# EAGLE design mutteruhr-Haus (EAGLE 7.7.0)
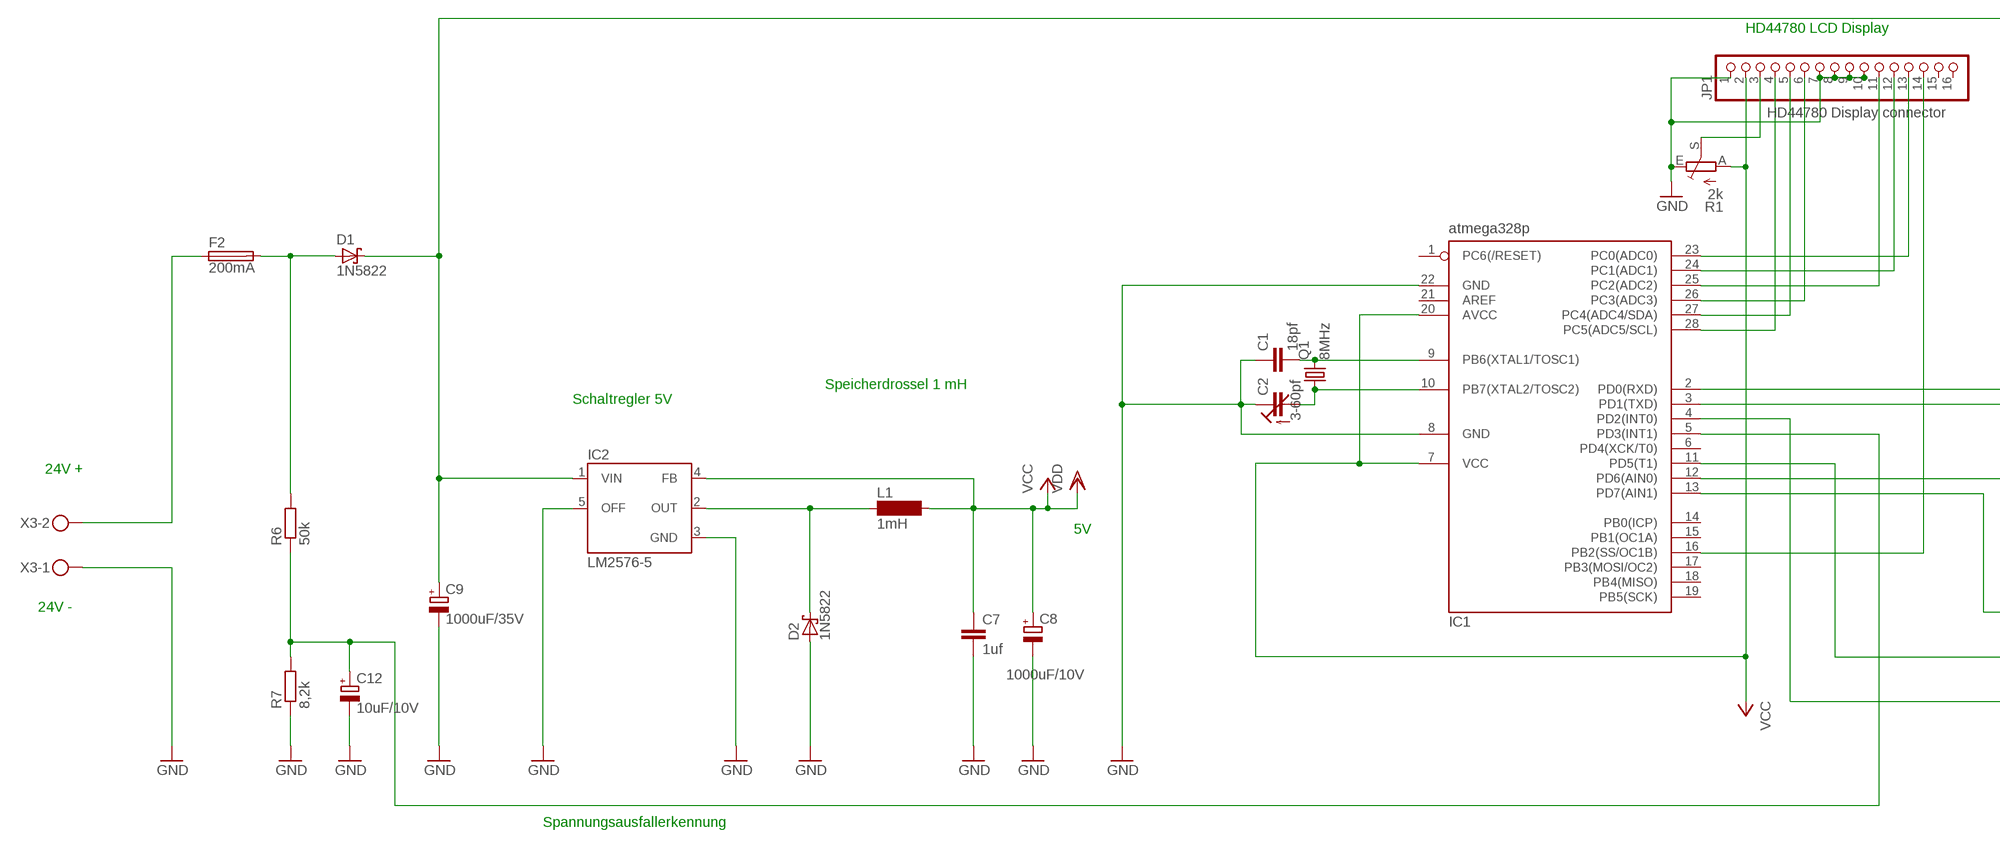
[diagram p0: schematic, sheet 1, part 1 of 2]
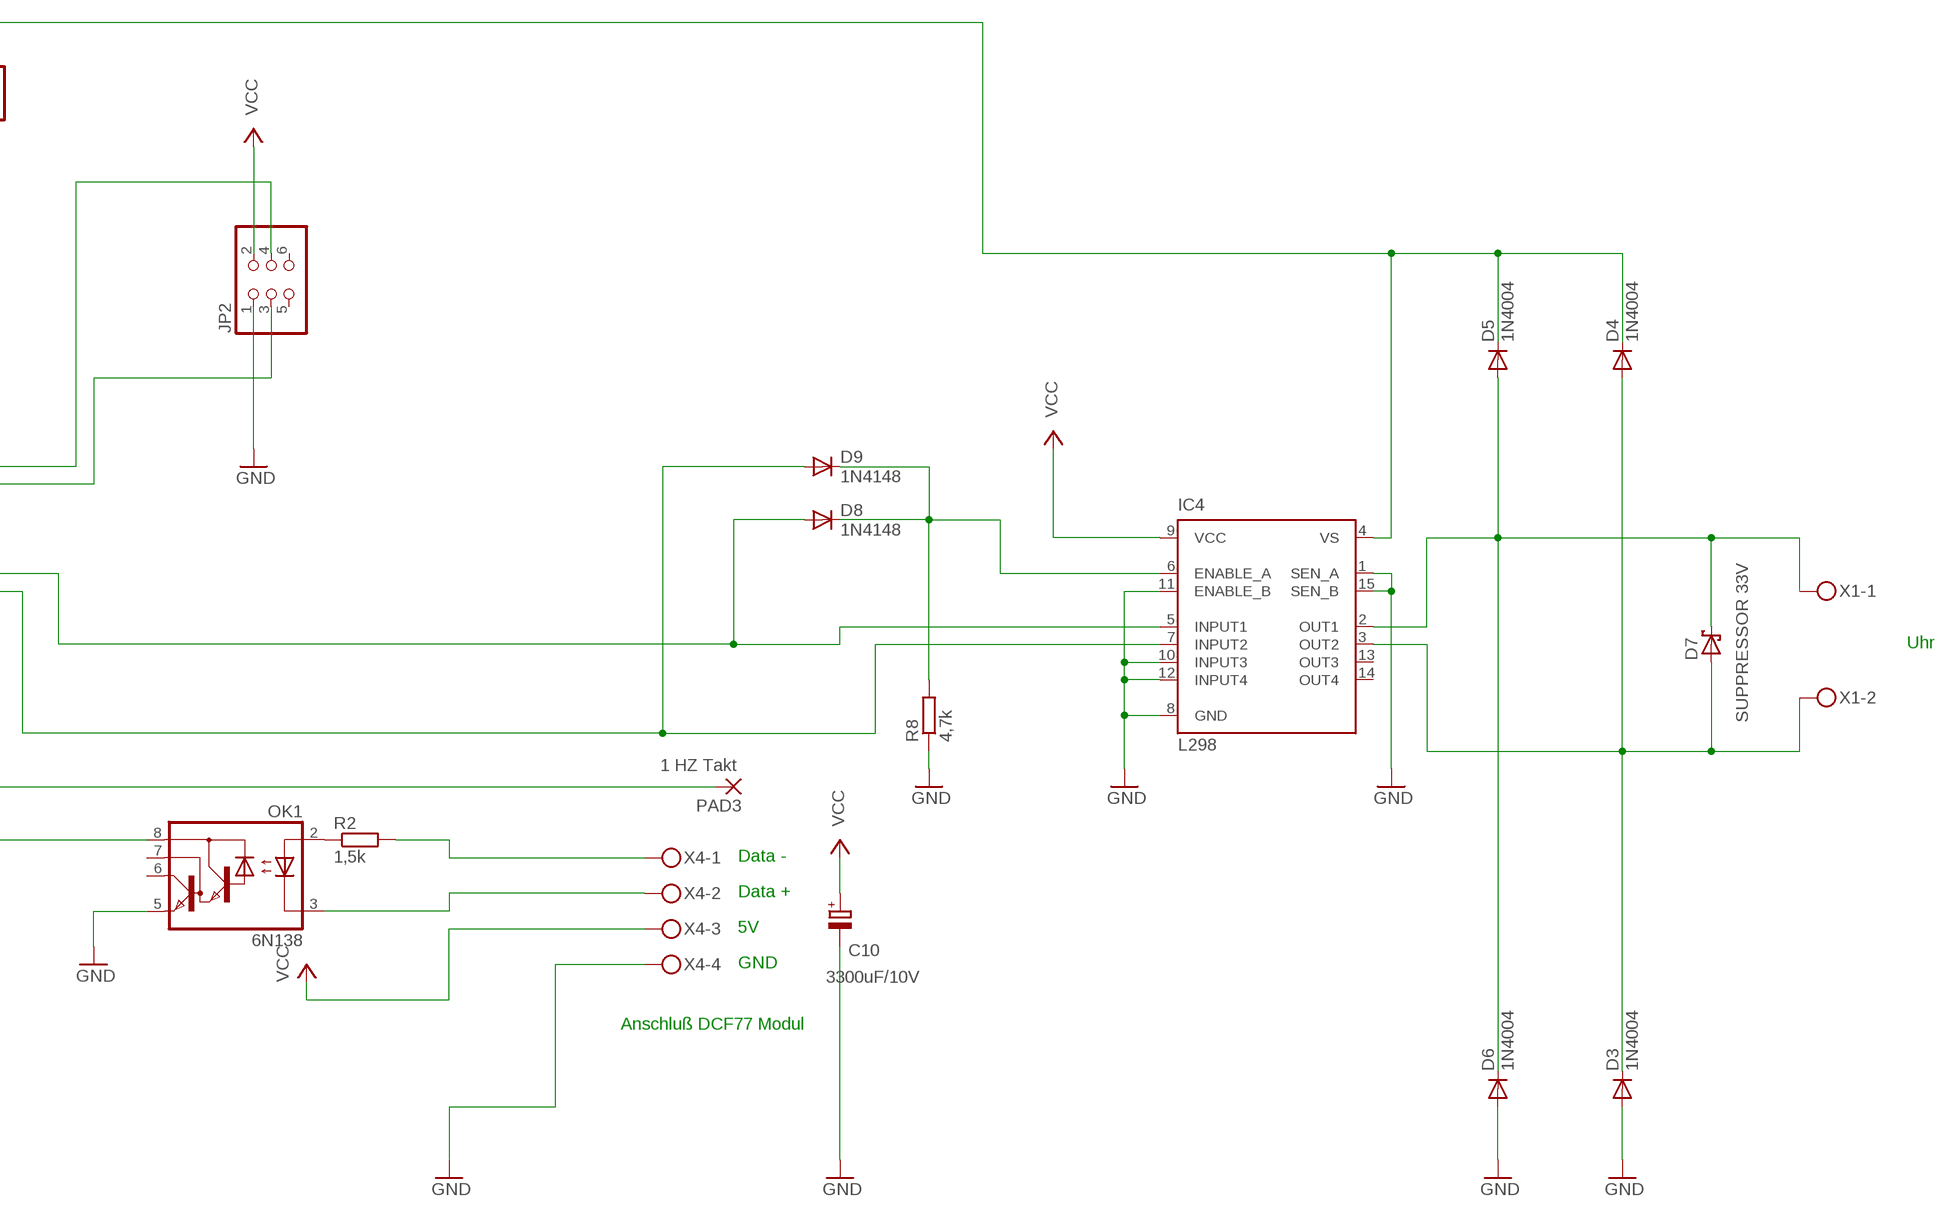
[diagram p1: schematic, sheet 1, part 2 of 2]

## Parts
C1  18pf  C-EU050-024X044  [C050-024X044]
C2  3-60pf  C-TRIMM3050.505  [CTRIM3050.505]
C7  1uf  C5/5.5  [C5B5.5]
C8  1000uF/10V  CPOL-EUE5-8.5  [E5-8,5]
C9  1000uF/35V  CPOL-EUE5-8.5  [E5-8,5]
C10  3300uF/10V  CPOL-EUE7.5-16  [E7,5-16]
C12  10uF/10V  CPOL-EUE5-5  [E5-5]
D1  1N5822  1N5819-B  [DO41-7.6]
D2  1N5822  1N5819-B  [DO41-7.6]
D3  1N4004  [DO41-10]
D4  1N4004  [DO41-10]
D5  1N4004  [DO41-10]
D6  1N4004  [DO41-10]
D7  SUPPRESSOR 33V  P4KEXX  [DO41-10]
D8  1N4148  1N4148DO35-7  [DO35-7]
D9  1N4148  1N4148DO35-7  [DO35-7]
F2  200mA  SH25  [SH25]
IC1  atmega328p  MEGA8-P  [DIL28-3]
IC2  LM2576-5  LM2576T  [TO220-5]
IC4  L298  [MULTIWATT-15]
JP1  HD44780 Display connector  PINHD-1X16_2.54  [1X16]
JP2  PINHD-2X3  [2X03]
L1  1mH  BS11  [BS11]
OK1  6N138  [DIL08]
PAD3  1 HZ Takt  2,54/0,8  [2,54/0,8]
Q1  8MHz  CRYSTALHC18U-V  [HC18U-V]
R1  2k  TRIM_EU-RS3  [RS3]
R2  1,5k  R-EU_0207/10  [0207/10]
R6  50k  R-EU_0207/10  [0207/10]
R7  8,2k  R-EU_0207/10  [0207/10]
R8  4,7k  R-EU_0207/10  [0207/10]
X1  MKDSN1,5/2-5,08  [MKDSN1,5/2-5,08]
X3  MKDSN1,5/2-5,08  [MKDSN1,5/2-5,08]
X4  MKDSN1,5/4-5,08  [MKDSN1,5/4-5,08]

## Nets
GND: C1.1 C2.1(E) C7.2 C8.- C9.- C10.- C12.- D2.A D3.A D6.A IC1.8(GND) IC1.22(GND) IC2.3(GND) IC2.5(OFF) IC4.1(SEN_A) IC4.8(GND) IC4.10(INPUT3) IC4.11(ENABLE_B) IC4.12(INPUT4) IC4.15(SEN_B) JP1.1 JP1.7 JP1.8 JP1.9 JP1.10 JP2.1 OK1.5(GND) R1.E R7.1 R8.1 X3.1 X4.4
N$1: IC1.4(PD2(INT0)) OK1.8(VCC)
N$2: C1.2 IC1.9(PB6(XTAL1/TOSC1)) Q1.2
N$3: C2.2(A) IC1.10(PB7(XTAL2/TOSC2)) Q1.1
N$4: IC1.23(PC0(ADC0)) JP1.13
N$5: IC1.24(PC1(ADC1)) JP1.12
N$6: IC1.25(PC2(ADC2)) JP1.11
N$7: IC1.26(PC3(ADC3)) JP1.6
N$8: IC1.27(PC4(ADC4/SDA)) JP1.5
N$9: IC1.28(PC5(ADC5/SCL)) JP1.4
N$10: IC1.16(PB2(SS/OC1B)) JP1.14
N$12: JP1.3 R1.S
N$14: IC1.2(PD0(RXD)) JP2.4
N$15: IC1.3(PD1(TXD)) JP2.3
N$22: D9.A IC1.13(PD7(AIN1)) IC4.7(INPUT2)
N$23: OK1.2(A) R2.1
N$25: IC1.11(PD5(T1)) PAD3.1(P)
N$26: D1.A F2.2 R6.2
N$27: OK1.3(C) X4.2
N$28: C9.+ D1.C D4.C D5.C IC2.1(VIN) IC4.4(VS)
N$29: F2.1 X3.2
N$32: R2.2 X4.1
N$33: C12.+ IC1.5(PD3(INT1)) R6.1 R7.2
N$39: D2.C IC2.2(OUT) L1.1
N$41: D8.C D9.C IC4.6(ENABLE_A) R8.2
N$43: D3.C D4.A D7.A IC4.3(OUT2) X1.2
N$44: D8.A IC1.12(PD6(AIN0)) IC4.5(INPUT1)
N$56: D5.A D6.C D7.C IC4.2(OUT1) X1.1
VCC: C7.1 C8.+ C10.+ IC1.7(VCC) IC1.20(AVCC) IC2.4(FB) IC4.9(VCC) JP1.2 JP2.2 L1.2 R1.A X4.3 ; supply symbol labelled VDD
Unconnected: IC1.1(PC6(/RESET)) IC1.6(PD4(XCK/T0)) IC1.14(PB0(ICP)) IC1.15(PB1(OC1A)) IC1.17(PB3(MOSI/OC2)) IC1.18(PB4(MISO)) IC1.19(PB5(SCK)) IC1.21(AREF) IC4.13(OUT3) IC4.14(OUT4) JP1.15 JP1.16 JP2.5 JP2.6 OK1.6(VO) OK1.7(VB)

## Notes on the sheet
- HD44780 LCD Display
- Speicherdrossel 1 mH
- Schaltregler 5V
- 24V +
- 5V
- Uhr
- 24V -
- Data -
- Data +
- 5V
- GND
- Spannungsausfallerkennung
- Anschluß DCF77 Modul

## Library data of the parts
C1 = rcl:C-EU: CAPACITOR, European symbol
C2 = rcl:C-TRIMM: Trimm capacitor
C7 = capacitor-wima:C: CAPACITOR naming: grid - package width
C8-C10 = rcl:CPOL-EU: POLARIZED CAPACITOR, European symbol
C12 = rcl-2:CPOL-EU: POLARIZED CAPACITOR, European symbol
D1 D2 = diode:1N581*: 1.0A SCHOTTKY BARRIER RECTIFIER Source: http://www.diodes.com/datasheets/ds23001.pdf
D3-D6 = diode:1N4004: DIODE general purpose rectifier, 1 A
D7 = diode:P4KEXX: DIODE transient-voltage suppressor
D8 D9 = diode:1N4148: DIODE high speed (Philips)
F2 = fuse:SH25: FUSE HOLDER grid 25 mm, OGN0031 8211, Schurter (Buerklin); MF: SCHURTER; MPN: 0031.8211; OC_FARNELL: 1162741; OC_NEWARK: 96B9380
IC1 = atmel:MEGA8-P: MICROCONTROLLER 8 Kbytes FLASH, 1 kbytes SRAM, 512 bytes EEPROM, USART, 4-channel 10 bit ADC, 2-channel 8 bit ADC Pin compatible with Atmega48, ATMega88, ATMega168 Source: avr.lbr
IC2 = v-reg-3:LM2576: National Semiconductor <http://www.national.com> 3.0A "Simple Switcher"(c) 52kHz, Vout 1.23-37V (HV: 57V), Vin 40V (HV: 60V), 50µA standby current
IC4 = st-microelectronics:L298: DUAL FULL-BRIDGE DRIVER; MPN: L298N; OC_FARNELL: 1589425; OC_NEWARK: 32M1527
JP1 = pinhead-2:PINHD-1X16: PIN HEADER
JP2 = pinhead:PINHD-2X3: PIN HEADER
L1 = inductor-neosid:BS: INDUCTOR nominal inductance, magnetically screened; OC_FARNELL: unknown; OC_NEWARK: unknown
OK1 = optocoupler:6N138: MOTOROLA OPTO COUPLER; MF: VISHAY/TELEFUNKEN; MPN: 6N138; OC_FARNELL: 9860150; OC_NEWARK: 35K5294
PAD3 = wirepad:2,54/0,8: THROUGH-HOLE PAD
Q1 = crystal:CRYSTAL: CRYSTAL
R1 = pot:TRIM_EU-: POTENTIOMETER
R2 R6-R8 = resistor:R-EU_: RESISTOR, European symbol
X1 X3 = con-phoenix-508:MKDSN1,5/2-5,08: MKDSN 1,5/ 2-5,08 Printklemme Nennstrom: 13,5 A Nennspannung: 250 V Rastermaß: 5,08 mm Polzahl: 2 Anschlussart: Schraubanschluss Montage: Löten Anschlussrichtung Leiter/Platine: 0 ° Artikelnummer: 1729128 Source: http://eshop.phoenixcontact.com .. 1729128.pdf; MPN: MKDSN 1,5/2-5.08; OC_FARNELL: 1792903; OC_NEWARK: 30M2397
X4 = con-phoenix-508:MKDSN1,5/4-5,08: MKDSN 1,5/ 4-5,08 Printklemme Nennstrom: 13,5 A Nennspannung: 250 V Rastermaß: 5,08 mm Polzahl: 4 Anschlussart: Schraubanschluss Montage: Löten Anschlussrichtung Leiter/Platine: 0 ° Artikelnummer: 1729144 Source: http://eshop.phoenixcontact.com .. 1729144.pdf; MPN: SMKDSN1,5/4-5,08; OC_FARNELL: 1792905; OC_NEWARK: 70R0300

## Board
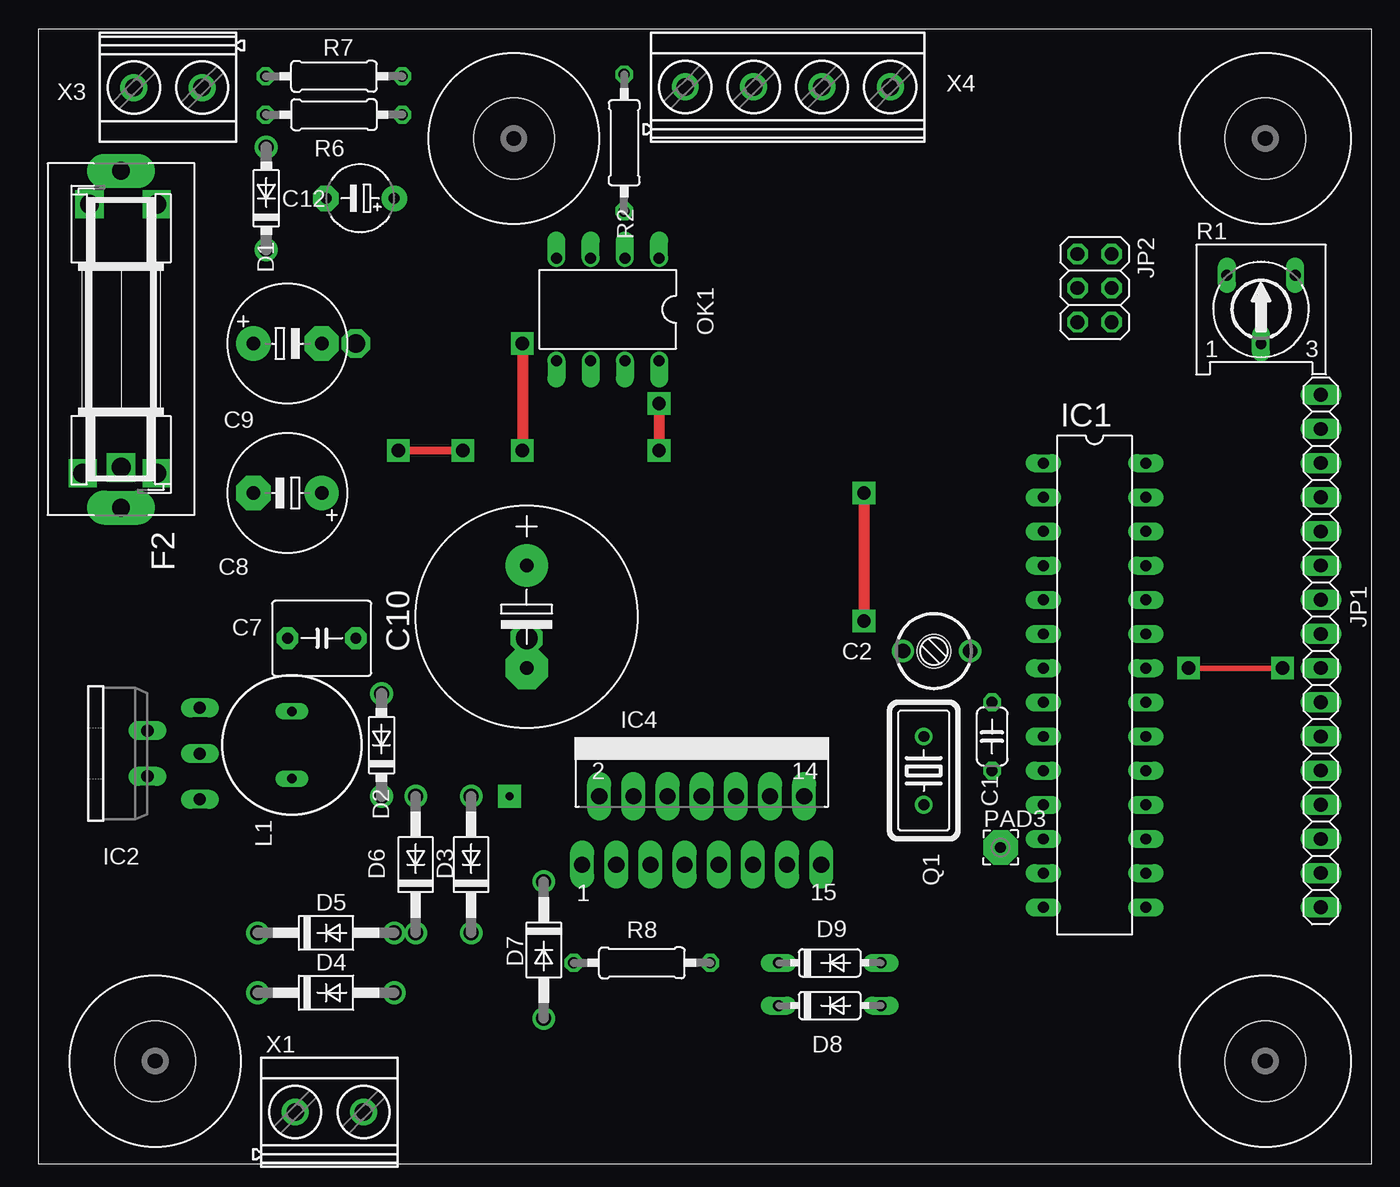
[diagram p2: board, top side]
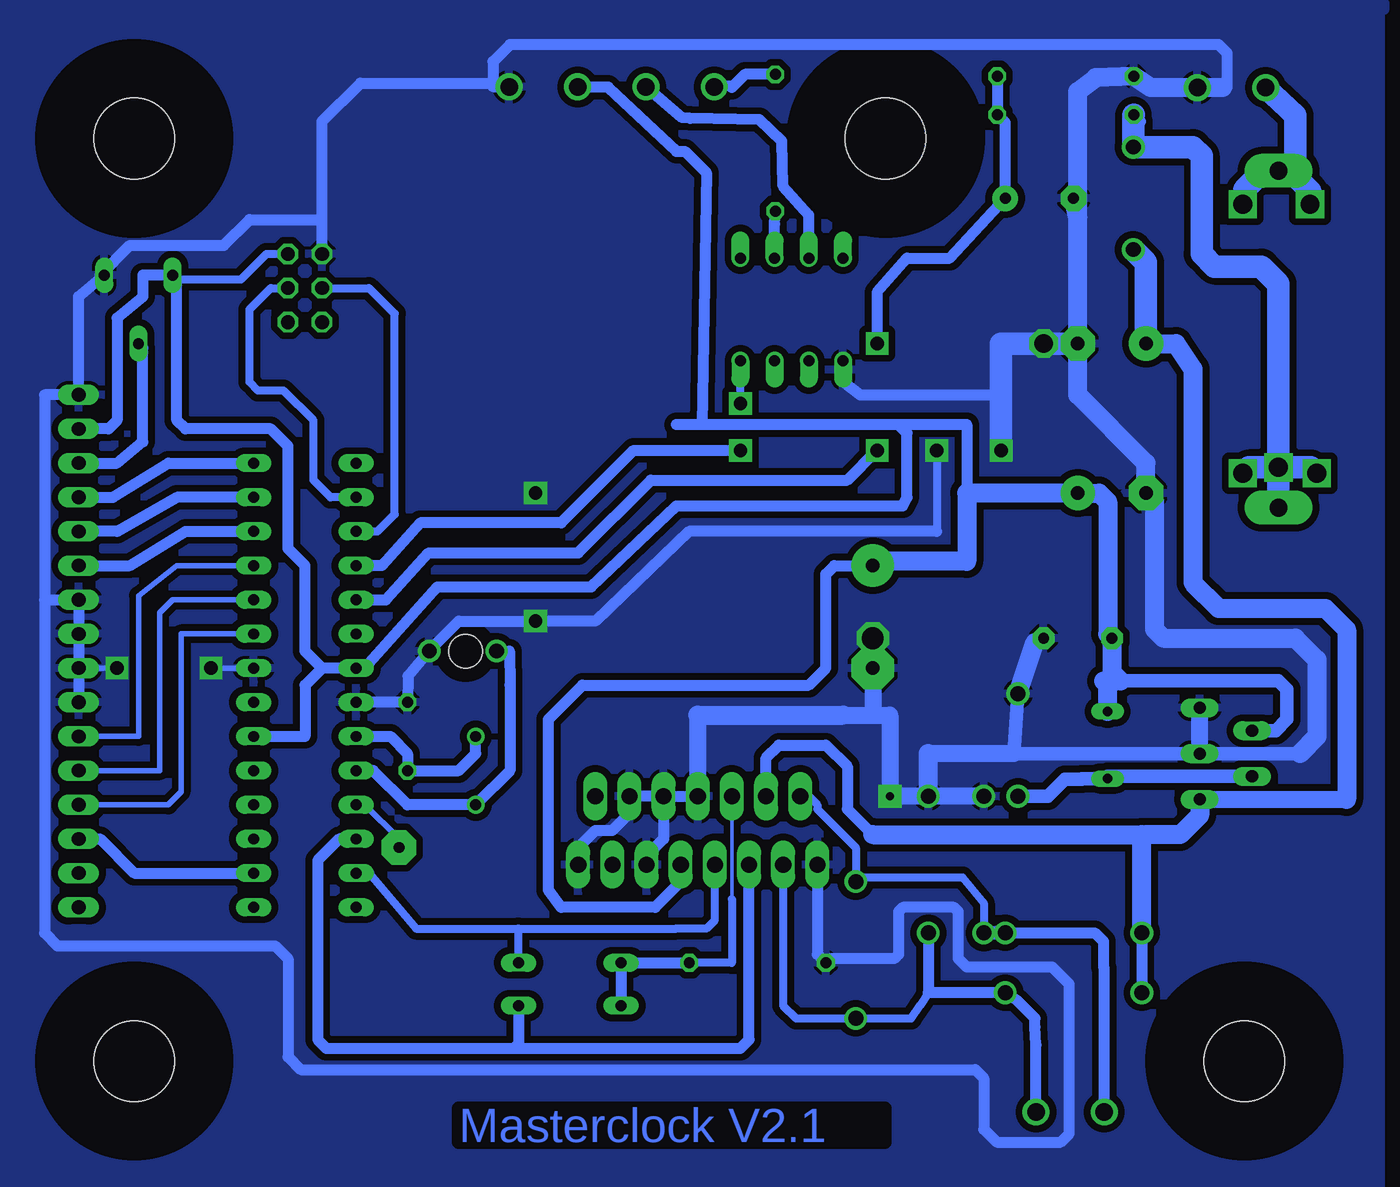
[diagram p3: board, bottom side, seen from below]

No outline drawn. Coordinates in mm, seen from the top.
Copper layers (1+16): Top 0.035mm / dielectric 1.5mm / Bottom 0.035mm
Design rules "default *": minimum track width 10mil, minimum drill 24mil, track to track 8mil, track to pad 8mil, pad to pad 8mil, via to via 8mil, smd to smd 8mil, copper to edge 40mil, drill to drill 8mil, minimum pad ring 10mil, minimum via ring 8mil, stop-mask expansion 4mil, vias tented up to drill 0mil, thermal gap 10mil

### Footprints (pad centres in the part's own frame; a part is rotated, then mirrored left to right if it is on the bottom)
C050-024X044 = drill 0.813 octagon: 1 -2.54,0; 2 2.54,0
CTRIM3050.505 = drill 1.1: 1 -2.5,0; 2 2.5,0 | hole 2.5: 0.2,0
C5B5.5 = drill 0.813 pad 1.6 octagon: 1 -2.54,0; 2 2.54,0
E5-8,5 = drill 1.016 pad 2.54: + -2.54,0 | drill 1.016 pad 2.54 octagon: - 2.54,0
E7,5-16 = drill 1.016 pad 3.15: + -3.81,0 | drill 1.016 pad 3.15 octagon: - 3.81,0
E5-5 = drill 0.813 pad 1.905: + -2.54,0 | drill 0.813 pad 1.905 octagon: - 2.54,0
DO41-7.6 = drill 1.1 pad 1.7: A 3.81,0; C -3.81,0
DO41-10 = drill 1.118: A 5.08,0; C -5.08,0
DO35-7 = drill 0.813 long: A 3.81,0; C -3.81,0
SH25 = drill 1.321 pad 2.54 long: 1 -12.522,0; 2 12.522,0
DIL28-3 = drill 0.813 long: 1 -16.51,-3.81; 2 -13.97,-3.81; 3 -11.43,-3.81; 4 -8.89,-3.81; 5 -6.35,-3.81; 6 -3.81,-3.81; 7 -1.27,-3.81; 8 1.27,-3.81; 9 3.81,-3.81; 10 6.35,-3.81; 11 8.89,-3.81; 12 11.43,-3.81; 13 13.97,-3.81; 14 16.51,-3.81; 15 16.51,3.81; 16 13.97,3.81; 17 11.43,3.81; 18 8.89,3.81; 19 6.35,3.81; 20 3.81,3.81; 21 1.27,3.81; 22 -1.27,3.81; 23 -3.81,3.81; 24 -6.35,3.81; 25 -8.89,3.81; 26 -11.43,3.81; 27 -13.97,3.81; 28 -16.51,3.81
TO220-5 = drill 0.9 long: 1 -3.4,-8.4; 2 -1.7,-4.5; 3 0,-8.4; 4 1.7,-4.5; 5 3.4,-8.4
MULTIWATT-15 = drill 1.2 long: 1 -8.89,-7.62; 2 -7.62,-2.54; 3 -6.35,-7.62; 4 -5.08,-2.54; 5 -3.81,-7.62; 6 -2.54,-2.54; 7 -1.27,-7.62; 8 0,-2.54; 9 1.27,-7.62; 10 2.54,-2.54; 11 3.81,-7.62; 12 5.08,-2.54; 13 6.35,-7.62; 14 7.62,-2.54; 15 8.89,-7.62
1X16 = drill 1.016 long: 1 -19.05,0; 2 -16.51,0; 3 -13.97,0; 4 -11.43,0; 5 -8.89,0; 6 -6.35,0; 7 -3.81,0; 8 -1.27,0; 9 1.27,0; 10 3.81,0; 11 6.35,0; 12 8.89,0; 13 11.43,0; 14 13.97,0; 15 16.51,0; 16 19.05,0
2X03 = drill 1.016 octagon: 1 -2.54,-1.27; 2 -2.54,1.27; 3 0,-1.27; 4 0,1.27; 5 2.54,-1.27; 6 2.54,1.27
BS11 = drill 0.7 long: 1 -2.5,0; 2 2.5,0
DIL08 = drill 0.813 offset: 1 -3.81,-3.81; 2 -1.27,-3.81; 3 1.27,-3.81; 4 3.81,-3.81; 5 3.81,3.81; 6 1.27,3.81; 7 -1.27,3.81; 8 -3.81,3.81
2,54/0,8 = drill 0.813 pad 2.54 octagon: 1 0,0
HC18U-V = drill 0.813: 1 -2.54,0; 2 2.54,0
RS3 = drill 0.813 long: A -2.54,2.54; E 2.54,2.54; S 0,-2.54
0207/10 = drill 0.813 octagon: 1 -5.08,0; 2 5.08,0
DRIL-6 = hole 6: 0,0
MKDSN1,5/2-5,08 = drill 1.3 pad 2: 1 -2.561,0.025; 2 2.519,0.025
MKDSN1,5/4-5,08 = drill 1.3 pad 2: 1 -7.641,0.025; 2 -2.561,0.025; 3 2.519,0.025; 4 7.599,0.025

### Placement (x,y rotation side)
C1  71.12,27.94 270 top
C2  66.99,34.29 180 top
C7  21.27,35.24 0 top
C8  18.73,46.04 180 top
C9  18.73,57.15 0 top
C10  36.51,36.83 270 top
C12  24.13,67.94 180 top
D1  17.14,67.94 90 top
D2  25.72,27.3 90 top
D3  32.38,18.41 90 top
D4  21.59,8.89 0 top
D5  21.59,13.34 0 top
D6  28.26,18.41 90 top
D7  37.78,12.06 270 top
D8  59.05,7.94 0 top
D9  59.05,11.11 0 top
F2  6.35,57.47 270 top
IC1  78.74,31.75 270 top
IC2  3.81,26.67 90 top
IC4  49.53,26.04 0 top
JP1  95.57,34.29 270 top
JP2  78.74,61.28 270 top
L1  19.05,27.3 90 top
OK1  42.55,59.69 180 top
PAD3  71.75,19.68 0 top
Q1  66.04,25.4 90 top
R1  91.12,59.69 0 top
R2  43.77,72.07 90 top
R6  22.18,74.16 180 top
R7  22.18,77.02 0 top
R8  45.09,11.11 0 top
U$1  [DRIL-6]  35.56,72.39 0 top
U$2  [DRIL-6]  8.89,3.81 0 top
U$3  [DRIL-6]  91.44,3.81 0 top
U$4  [DRIL-6]  91.44,72.39 0 top
X1  21.86,0 0 top
X3  9.82,76.2 180 top
X4  55.95,76.2 0 top

### Tracks (layer width: path | path; a pad name or v marks a point on that pad's centre or on a via)
GND  (via drill 0.6 pad 1.68, 1 pad 1.68, 1.4, 1.6)
  Top 0.406: v85.72,33.02 v92.71,33.02
  Top 0.61: v26.99,49.21 v31.75,49.21
  Top 0.813: v61.59,46.04 v61.59,36.51
  Bottom 0.406: X3.1 10.5,76.17 | IC1.22 v85.72,33.02 | v92.71,33.02 JP1.9
  Bottom 0.61: v31.75,49.21 31.75,43.18 | 63.84,76.52 X4.4
  Bottom 0.813: 98.11,38.1 98.11,53.34 JP1.1 95.57,60.64 93.97,61.97 | 98.11,38.1 JP1.7 JP1.8 JP1.9 JP1.10 | 93.97,61.97 R1.E | IC4.10 IC4.12 54.61,22.23 55.88,20.95 57.15,20.95 58.42,19.68 IC4.15 | IC4.10 52.07,20.32 53.34,19.05 IC4.11 | IC4.10 IC4.8 | 31.75,43.18 50.16,43.18 57.15,36.51 v61.59,36.51 67.31,36.51 69.53,34.29 C2.1 71.08,32.42 C1.1 IC1.8 | 26.99,53.34 37.47,53.34 38.73,54.29 OK1.5 | X3.1 10.16,76.2 10.16,78.74 10.79,79.38 63.5,79.38 64.77,78.11 64.77,76.25 X4.4 | 98.11,38.1 98.11,13.34 97.16,12.38 80.96,12.38 80.01,11.43 80.01,4.13 79.06,3.17 28.89,3.17 28.26,2.54 28.26,-1.27 27.3,-2.22 22.54,-2.22 21.91,-1.59 21.91,9.53 23.18,10.79 29.53,10.79 30.16,11.43 30.16,14.92 30.48,15.24 34.29,15.24 34.61,14.92 34.61,11.75 34.92,11.43 39.69,11.43 R8.1 40.64,11.75 IC4.1 | JP2.1 77.47,66.36 | 77.47,66.36 77.47,73.66 74.61,76.52 63.84,76.52 | 93.97,61.97 93.97,62.24 91.76,64.45 84.77,64.45 82.87,66.36 77.47,66.36
  Bottom 1.016: D2.A 26.04,26.67 12.7,26.67 4.76,26.67
  Bottom 1.27: IC4.8 49.53,29.53 36.51,29.53 | 36.51,29.53 35.24,29.53 v35.24,23.5 D3.A D6.A | C10.- 36.51,29.53 | 12.7,26.67 IC2.3 IC2.5 | 26.04,26.67 32.38,26.67
  Bottom 1.422: D3.A 32.38,26.67 | 10.5,76.17 15.85,76.17 R7.1 19.95,76.92 21.27,75.89 21.27,66.36 | 21.27,66.36 C9.- 21.27,53.34 16.19,48.26 C8.- 15.56,45.4 15.56,35.88 14.92,35.24 5.08,35.24 3.49,33.66 3.49,27.94 4.76,26.67 | C12.- 21.27,66.36 | D2.A 24.45,34.92 C7.2 | 49.53,29.53 38.73,29.53 | C10.- v36.51,35.24
  Bottom 1.676: v26.99,49.21 26.99,53.34 26.99,57.15 v23.81,57.15 C9.-
  pour Bottom (isolate 0.508): -1.27,81.92 -1.27,-6.03 102.23,-6.03 102.23,82.55 -1.59,82.55 -1.59,81.92
N$1  (via drill 1 pad 1.68)
  Top 0.813: v46.35,52.7 v46.35,49.21
  Bottom 0.61: v46.35,52.7 OK1.8
  Bottom 0.813: IC1.4 73.03,40.64 70.17,43.81 59.69,43.81 54.29,49.21 v46.35,49.21
N$2
  Bottom 0.813: IC1.9 72.39,27.94 71.12,26.67 C1.2 67.31,25.4 66.04,26.67 Q1.2
N$3
  Bottom 0.813: C2.2 63.54,34.29 63.5,31.75 63.5,25.4 Q1.1 71.12,22.86 73.66,25.4 IC1.10
N$4
  Bottom 0.406: IC1.23 87.95,35.56 87.95,23.81 88.9,22.86 JP1.13
N$5
  Bottom 0.406: JP1.12 89.53,25.4 89.53,37.15 88.58,38.1 IC1.24
N$6
  Bottom 0.406: IC1.25 88.27,40.64 91.12,38.42 91.12,27.94 JP1.11
N$7
  Bottom 0.813: JP1.6 91.76,40.64 87.63,43.18 IC1.26
N$8
  Bottom 0.813: IC1.27 88.27,45.72 92.71,43.18 JP1.5
N$9
  Bottom 0.813: JP1.4 93.03,45.72 88.9,48.26 IC1.28
N$10
  Bottom 0.813: JP1.14 93.98,20.32 91.44,17.78 IC1.16
N$11
  pour Bottom (isolate 0.508): -0.32,80.96 -0.32,-4.76 100.33,-4.76 100.33,81.6 100.01,81.6 100.01,80.96
N$12
  Bottom 0.813: JP1.3 92.71,48.26 90.81,49.85 90.81,56.83 R1.S
N$14
  Bottom 0.61: IC1.2 76.83,45.72 78.11,46.99 78.11,51.44 80.33,53.66 82.23,53.66 82.87,54.29 82.87,59.69 81.28,61.28 JP2.4
N$15
  Bottom 0.61: IC1.3 73.34,43.18 72.07,44.45 72.07,59.37 73.98,61.28 JP2.3
N$16
  Bottom 1.422: 18.41,32.07 19.05,32.07
N$22
  Bottom 0.61: IC4.7 48.26,14.29 48.9,13.65 51.12,13.65 62.87,13.65 | 73.98,17.78 70.48,13.65 62.87,13.65 | D9.A 62.87,13.65
  Bottom 0.813: IC1.13 73.98,17.78
N$23
  Bottom 0.813: OK1.2 43.81,66.04 R2.1
N$25
  Bottom 0.406: IC1.11 74.3,22.86 71.75,20.32 PAD3.1
N$26  (via drill 1.4)
  Bottom 0.813: R6.2 16.61,73.66
  Bottom 1.676: R6.2 17.14,74.12 D1.A 12.7,71.75 12.06,71.12 12.06,63.82 11.11,62.87 7.62,62.87 6.35,61.59 v6.35,47.94 | v6.35,47.94 F2.2 | v6.35,47.94 8.56,47.94 v9,47.5 | v6.35,47.94 3.94,47.94 v3.5,47.5
N$27
  Bottom 0.813: OK1.3 41.27,66.7 43.18,68.84 43.28,72.2 44.95,73.79 50.1,73.89 50.7,73.94 X4.2
N$28
  Bottom 0.813: IC4.4 44.45,26.35 43.5,27.3 40.01,27.3 38.42,25.72 38.42,22.54 36.51,20.64 | D5.C D4.C
  Bottom 1.27: IC2.1 1.27,23.27 1.27,23.18
  Bottom 1.422: 36.51,20.64 16.51,20.64 | 16.51,20.64 16.19,20.64 | C9.+ 13.97,57.15 12.7,55.24 12.7,39.37 10.79,37.47 2.86,37.47 1.27,35.88 1.27,23.27 | IC2.1 12.21,22.08 13.65,20.64 16.19,20.64 | 16.19,20.64 16.51,20.32 | D5.C 16.51,20.64
  Bottom 1.676: C9.+ 16.19,63.18 D1.C
N$29  (via drill 1.4)
  Bottom 1.676: X3.2 5.08,74.11 5.08,70.8 5.71,70.17 | 5.71,70.17 5.89,69.99 F2.1 7.48,69.99 8.89,68.58 8.89,67.61 v9,67.5 | v4,67.5 4,68.45 5.71,70.17
N$32
  Bottom 0.813: R2.2 46.04,77.15 46.99,76.2 46.98,76.3 X4.1
N$33  (via drill 1 pad 1.68)
  Top 0.813: v36.2,57.15 v36.2,49.21
  Bottom 0.813: IC1.5 72.71,38.1 69.53,41.59 58.42,41.59 53.02,46.99 38.42,46.99 v36.2,49.21 | v36.2,57.15 36.2,60.96 33.97,63.5 30.8,63.5 C12.+ 26.67,73.56 R6.1 R7.2
N$39
  Bottom 1.016: IC2.2 19.05,24.97 L1.1 20.95,24.8 20.95,24.77 22.23,24.77 23.5,23.5 D2.C
N$41
  Bottom 0.254: IC4.6 46.99,15.88
  Bottom 0.61: 46.99,15.88 46.99,11.11 R8.2
  Bottom 0.813: D8.C D9.C R8.2
N$43
  Bottom 0.61: IC4.3 43.18,7.94 42.23,6.99 D7.A 33.66,6.99 33.02,7.94 32.38,8.89
  Bottom 0.813: X1.2 24.38,5.01 24.45,6.35 24.45,6.99 25.72,8.26 D4.A 32.38,8.89 D3.C
N$44
  Bottom 0.813: IC1.12 76.2,20.32 77.79,18.73 77.79,5.4 77.15,4.76 63.18,4.76 | 63.18,4.76 46.35,4.76 45.72,5.4 IC4.5 | D8.A 62.87,5.08 63.18,4.76
N$56
  Bottom 0.61: IC4.2 41.27,23.5 40.64,22.86 40.64,22.54 37.78,19.68 37.78,17.46 | 37.78,17.46 D7.C 37.78,16.83 | 37.78,17.46 29.84,17.46 28.26,15.56 D6.C
  Bottom 0.813: X1.1 19.3,10.73 19.37,10.79 19.37,12.7 20,13.34 26.35,13.34 26.36,13.34 D5.A
  Bottom 1.016: D6.C D5.A
VCC
  Bottom 0.61: 88.27,61.91 83.5,61.91 81.6,63.82 JP2.2
  Bottom 0.813: 29.53,46.04 29.53,51.12 34.61,51.12 | 77.47,33.02 IC1.7 74.3,33.02 68.9,39.05 57.47,39.05 51.12,45.09 34.29,45.09 33.97,45.72 33.97,50.48 34.61,51.12 | 77.47,33.02 78.74,31.75 78.74,27.94 IC1.20 | C10.+ 37.15,40.64 39.37,40.64 40.01,40.01 40.01,33.02 41.27,31.75 58.1,31.75 60.64,29.21 60.64,16.51 59.69,15.24 52.7,15.24 50.8,17.14 IC4.9 | 77.47,33.02 78.74,34.29 78.74,40.64 80.01,41.91 80.01,49.53 81.28,50.8 87.63,50.8 88.27,51.44 88.27,61.91 R1.A 90.81,62.23 90.81,60.64 92.71,59.05 92.71,51.44 93.34,50.8 JP1.2 | 34.61,51.12 49.21,51.12 | 49.21,51.12 48.9,69.85 50.48,71.44 51.12,71.44 56.2,76.2 58.45,76.2 X4.3 | 49.21,51.12 51.12,51.12
  Bottom 1.016: IC2.4 6.55,28.37 5.71,29.21 5.71,31.43 6.35,32.07 18.1,32.07
  Bottom 1.422: 37.15,40.64 36.83,40.96 29.53,40.96 29.53,46.04 C8.+ 19.68,46.04 19.05,45.4 19.05,35.56 C7.1 18.73,32.7 18.1,32.07 19.05,32.07 | 19.05,32.07 19.37,32.07 | L1.2 19.05,32.07

### Text on the board
Bottom: Masterclock V2.1